# EAGLE design flync_node (EAGLE 9.6.2)
FLYNC/FIND battery-free sensor node

## Sheet 1 of 2
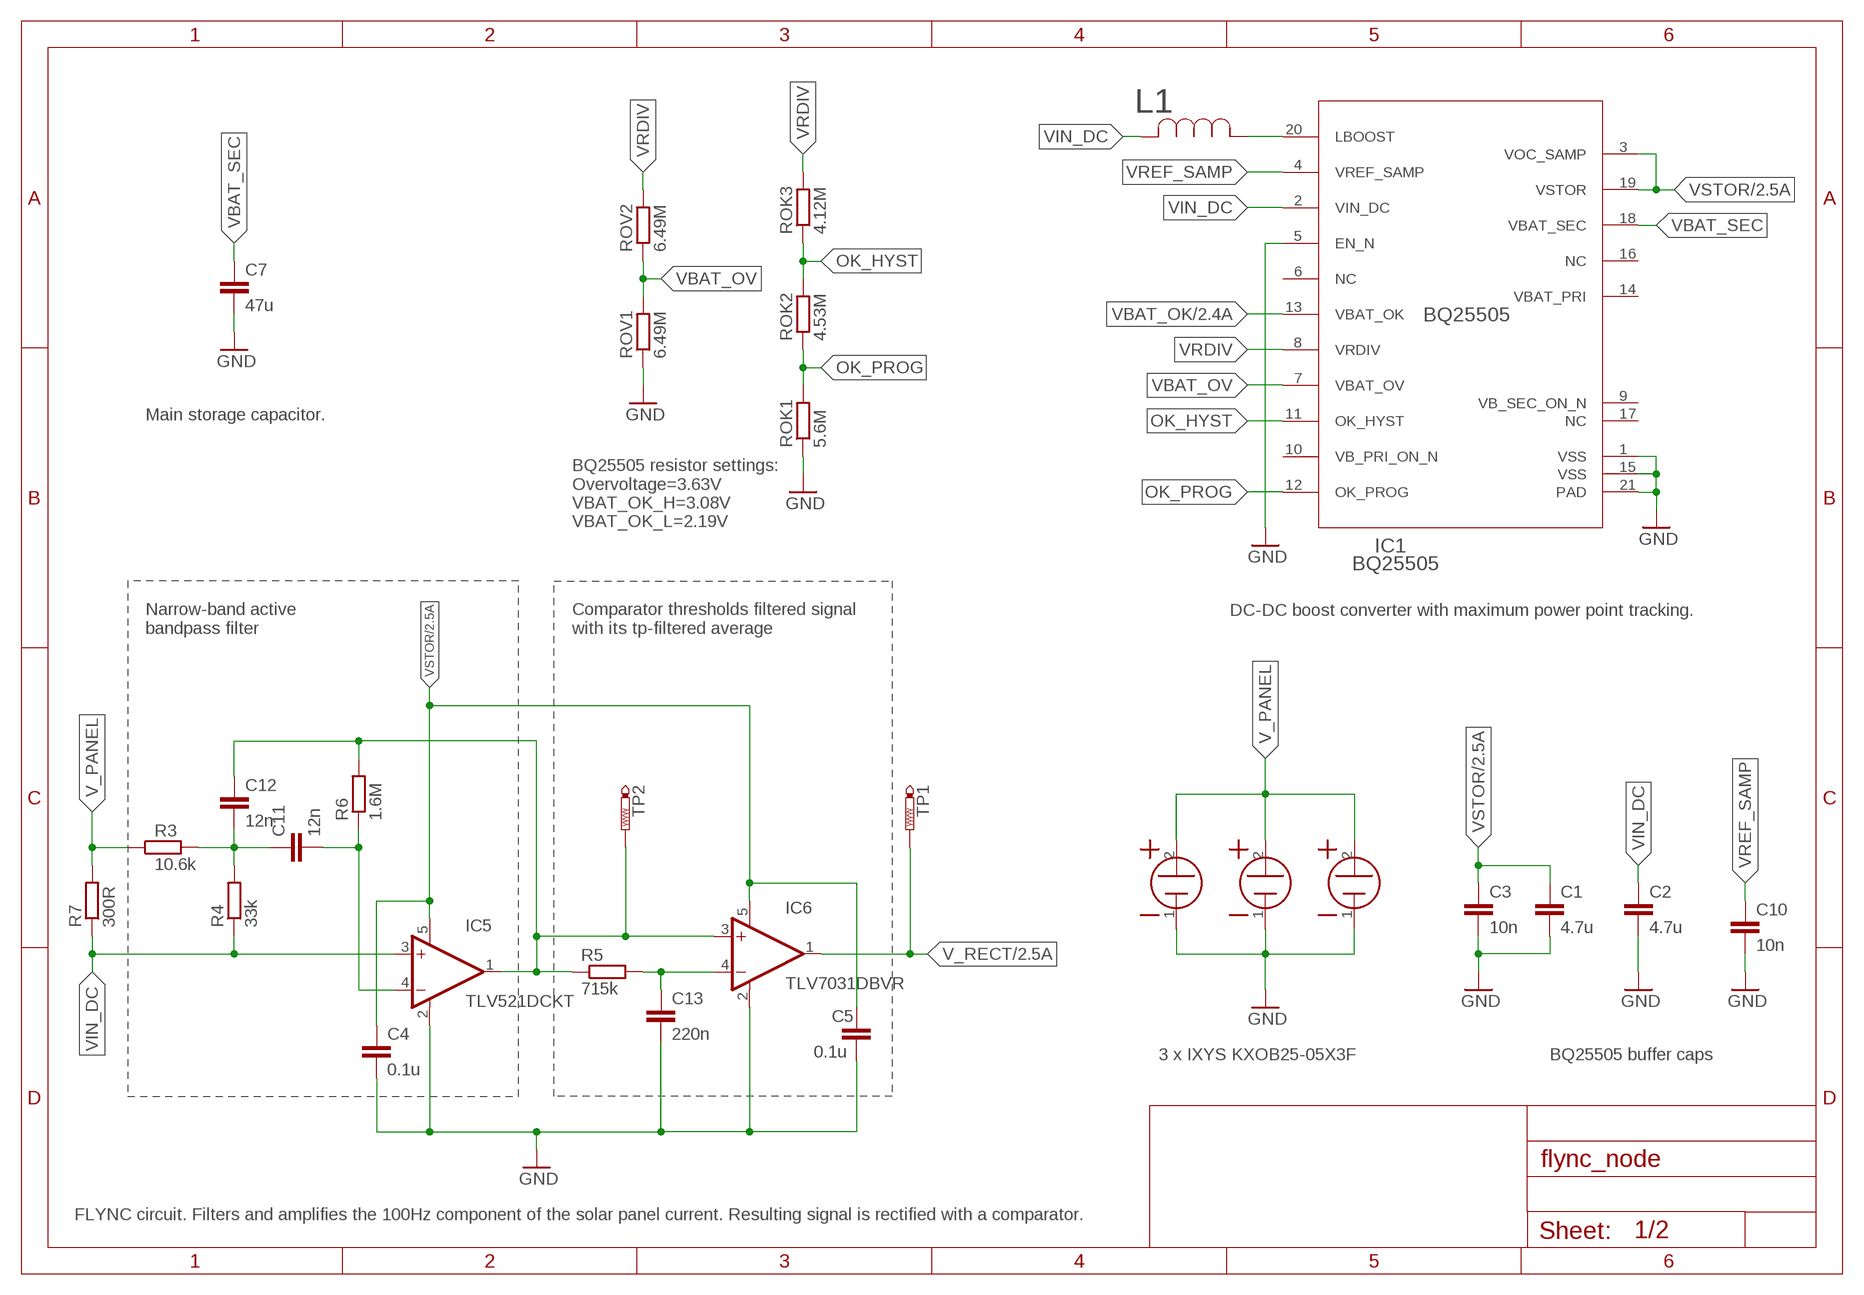
[diagram p0: schematic, sheet 1]

### Parts
C1  4.7u  C_SMD0402  [CAPC1005X55]
C2  4.7u  C_SMD0402  [CAPC1005X55]
C3  10n  C_SMD0402  [CAPC1005X55]
C4  0.1u  C_SMD0402  [CAPC1005X55]
C5  0.1u  C_SMD0402  [CAPC1005X55]
C7  47u  C_SMD0805  [CAPC2012X145]
C10  10n  C_SMD0402  [CAPC1005X55]
C11  12n  C_SMD0805  [CAPC2012X145]
C12  12n  C_SMD0805  [CAPC2012X145]
C13  220n  C_SMD0402  [CAPC1005X55]
H1  IXYSKXOB25-05X3F  [IXYS23X8]
H2  IXYSKXOB25-05X3F  [IXYS23X8]
H3  IXYSKXOB25-05X3F  [IXYS23X8]
IC1  BQ25505  [RGR0020A]
IC5  TLV521DCKT  [DCK5]
IC6  TLV7031DBVR  [DBV5-L]
L1  LBR2518T220KIND1007_47N_TAI-L  [IND1007_47N_TAI-L]
R3  10.6k  R_SMD0402  [RESC1005X40]
R4  33k  R_SMD0402  [RESC1005X40]
R5  715k  R_SMD0402  [RESC1005X40]
R6  1.6M  R_SMD0402  [RESC1005X40]
R7  300R  R_SMD0603  [RESC1608X55]
ROK1  5.6M  R_SMD0402  [RESC1005X40]
ROK2  4.53M  R_SMD0402  [RESC1005X40]
ROK3  4.12M  R_SMD0402  [RESC1005X40]
ROV1  6.49M  R_SMD0402  [RESC1005X40]
ROV2  6.49M  R_SMD0402  [RESC1005X40]
TP1  PTR1TP08R  [TP08R]
TP2  PTR1TP08R  [TP08R]

### Nets
GND: C1.2 C2.2 C3.2 C4.2 C5.2 C7.2 C10.2 C13.2 H1.1 H2.1 H3.1 IC1.1(VSS) IC1.5(EN_N) IC1.15(VSS) IC1.21(PAD) IC5.2(V-) IC6.2(V-) ROK1.1 ROV1.1 ; also sheet 2
N$1: IC1.20(LBOOST) L1.1
N$2: C11.1 C12.2 R3.2 R4.2
N$3: C11.2 IC5.4(-IN) R6.1
N$4: C12.1 IC5.1(OUT) IC6.3(+IN) R5.1 R6.2 TP2.TP
N$8: C13.1 IC6.4(-IN) R5.2
OK_HYST: IC1.11(OK_HYST) ROK2.2 ROK3.1
OK_PROG: IC1.12(OK_PROG) ROK1.2 ROK2.1
V_PANEL: H1.2 H2.2 H3.2 R3.1 R7.2
V_RECT: IC6.1(OUT) TP1.TP ; also sheet 2
VBAT_OK: IC1.13(VBAT_OK) ; also sheet 2
VBAT_OV: IC1.7(VBAT_OV) ROV1.2 ROV2.1
VBAT_SEC: C7.1 IC1.18(VBAT_SEC)
VIN_DC: C2.1 IC1.2(VIN_DC) IC5.3(+IN) L1.2 R4.1 R7.1
VRDIV: IC1.8(VRDIV) ROK3.2 ROV2.2
VREF_SAMP: C10.1 IC1.4(VREF_SAMP)
VSTOR: C1.1 C3.1 C4.1 C5.1 IC1.3(VOC_SAMP) IC1.19(VSTOR) IC5.5(V+) IC6.5(V+) ; also sheet 2
Unconnected: IC1.6(NC) IC1.10(VB_PRI_ON_N) IC1.16(NC) IC1.17(NC)

### Notes on the sheet
- Main storage capacitor.
- BQ25505 resistor settings:
  Overvoltage=3.63V
  VBAT_OK_H=3.08V
  VBAT_OK_L=2.19V
- DC-DC boost converter with maximum power point tracking.
- Narrow-band active
  bandpass filter
- Comparator thresholds filtered signal
  with its tp-filtered average
- 3 x IXYS KXOB25-05X3F | BQ25505 buffer caps
- FLYNC circuit. Filters and amplifies the 100Hz component of the solar panel current. Resulting signal is rectified with a comparator.

## Sheet 2 of 2
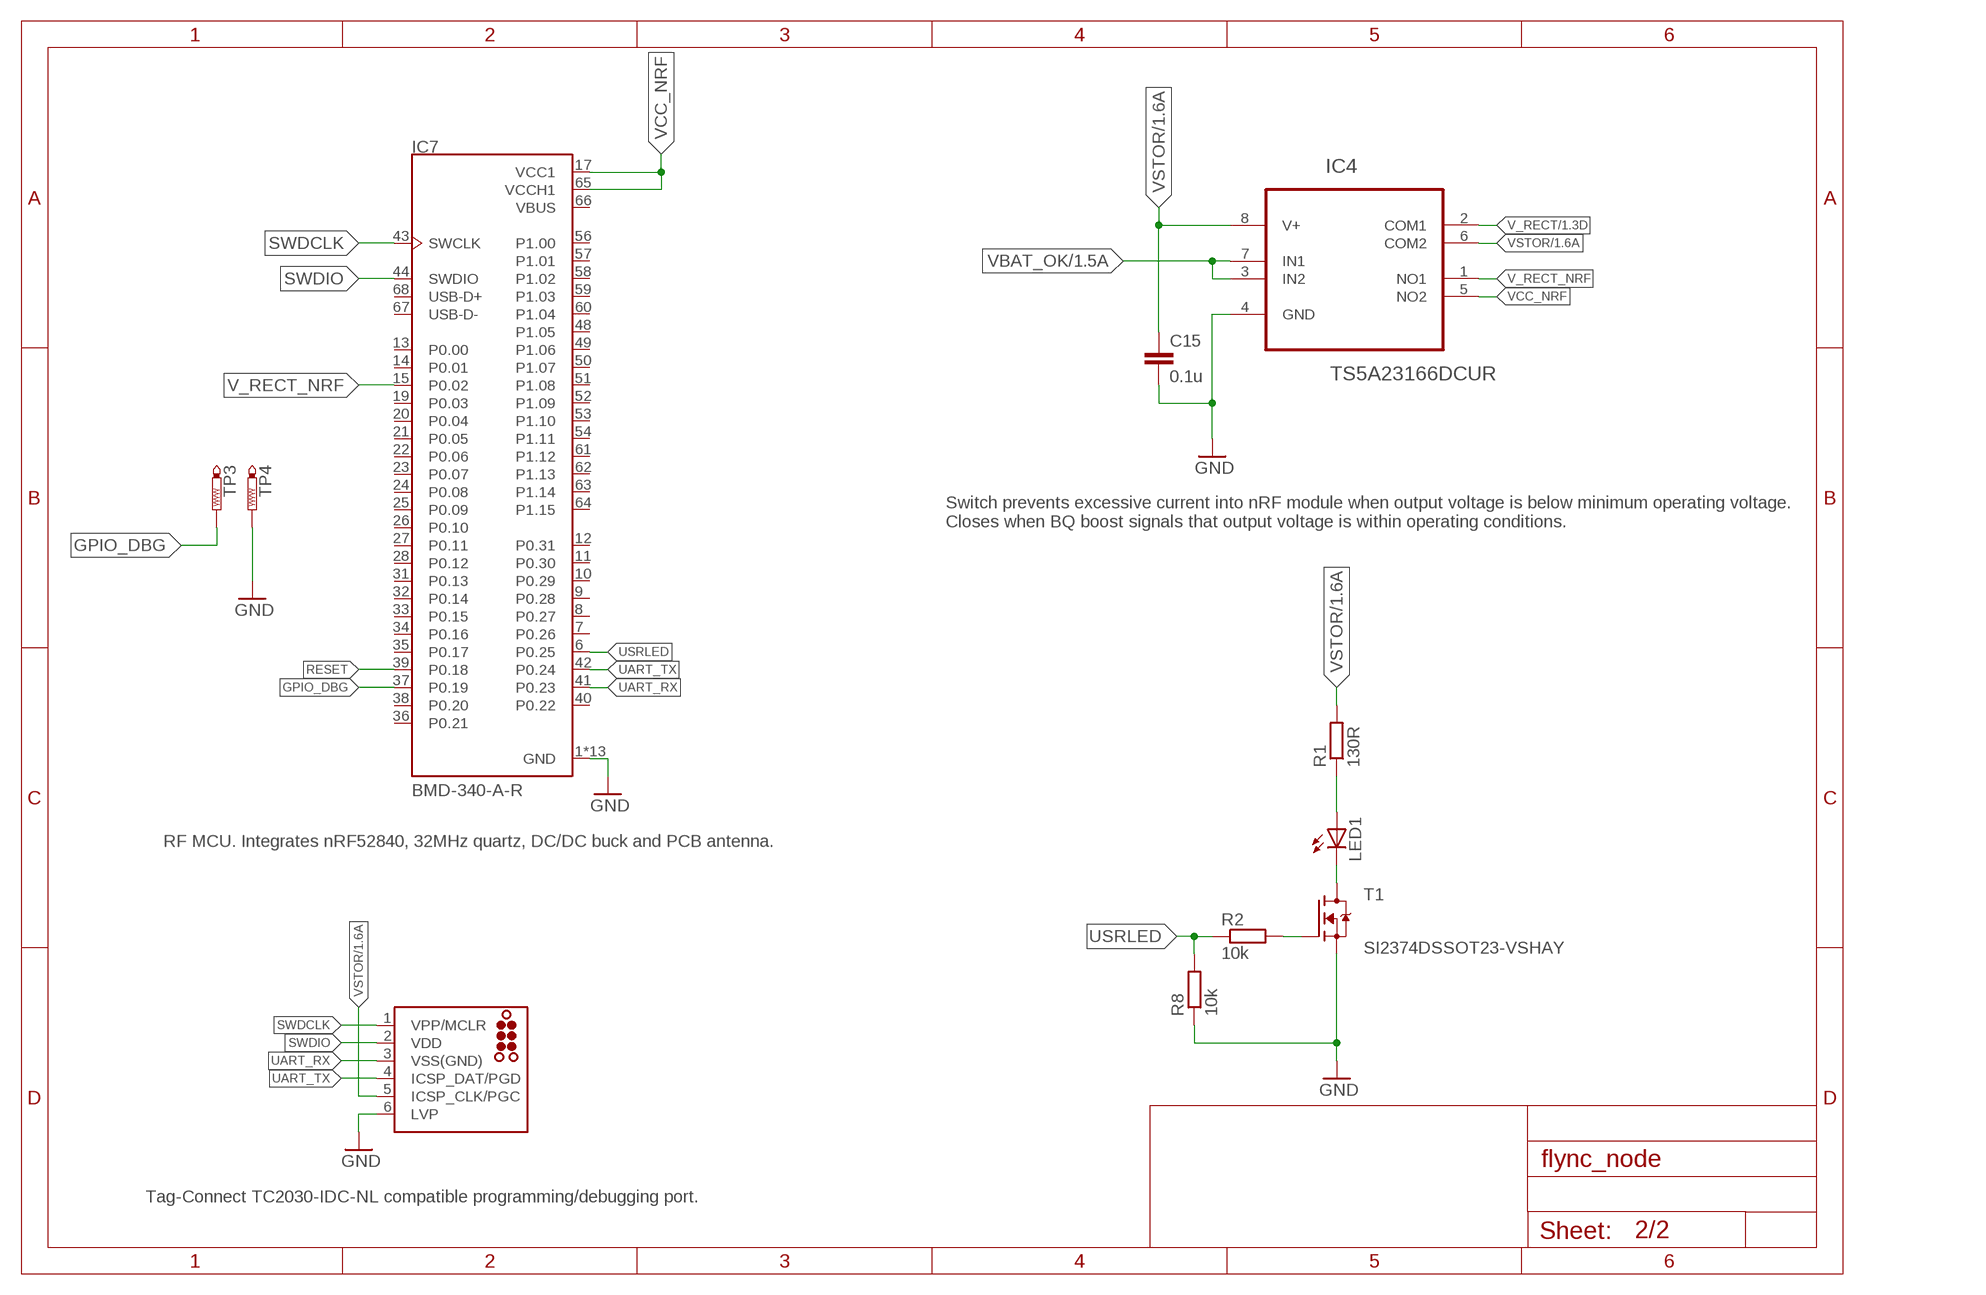
[diagram p1: schematic, sheet 2]

### Parts
C15  0.1u  C_SMD0402  [CAPC1005X55]
IC4  TS5A23166DCUR  [SOP50P310X90-8N]
IC7  BMD-340-A-R  [RIGADO_BMD-340-A-R]
J1  TC2030-MCP-NL  [TC2030-MCP-NL]
LED1  598-8130-107FLED_0805  [LEDC2012X75]
R1  130R  R_SMD0603  [RESC1608X55]
R2  10k  R_SMD0402  [RESC1005X40]
R8  10k  R_SMD0402  [RESC1005X40]
T1  SI2374DSSOT23-VSHAY  [SOT95P237X112-3]
TP3  PTR1TP16SQ  [TP16SQ]
TP4  PTR1TP16SQ  [TP16SQ]

### Nets
GND: C15.2 IC4.4(GND) IC7.1(GND) IC7.2(GND) IC7.3(GND) IC7.4(GND) IC7.5(GND) IC7.16(GND) IC7.18(GND) IC7.29(GND) IC7.30(GND) IC7.45(GND) IC7.46(GND) IC7.47(GND) IC7.55(GND) J1.6(LVP) R8.1 T1.2(S) TP4.TP ; also sheet 1
GPIO_DBG: IC7.37(P0.19) TP3.TP
N$5: LED1.2(A) R1.1
N$6: LED1.1(C) T1.3(D)
N$9: R2.2 T1.1(G)
RESET: IC7.39(P0.18)
SWDCLK: IC7.43(SWCLK) J1.1(VPP/MCLR)
SWDIO: IC7.44(SWDIO) J1.2(VDD)
UART_RX: IC7.41(P0.23) J1.3(VSS(GND))
UART_TX: IC7.42(P0.24) J1.4(ICSP_DAT/PGD)
USRLED: IC7.6(P0.25) R2.1 R8.2
V_RECT: IC4.2(COM1) ; also sheet 1
V_RECT_NRF: IC4.1(NO1) IC7.15(P0.02)
VBAT_OK: IC4.3(IN2) IC4.7(IN1) ; also sheet 1
VCC_NRF: IC4.5(NO2) IC7.17(VCC1) IC7.65(VCCH1)
VSTOR: C15.1 IC4.6(COM2) IC4.8(V+) J1.5(ICSP_CLK/PGC) R1.2 ; also sheet 1
Unconnected: IC7.7(P0.26) IC7.8(P0.27) IC7.9(P0.28) IC7.10(P0.29) IC7.11(P0.30) IC7.12(P0.31) IC7.13(P0.00) IC7.14(P0.01) IC7.19(P0.03) IC7.20(P0.04) IC7.21(P0.05) IC7.22(P0.06) IC7.23(P0.07) IC7.24(P0.08) IC7.25(P0.09) IC7.26(P0.10) IC7.27(P0.11) IC7.28(P0.12) IC7.31(P0.13) IC7.32(P0.14) IC7.33(P0.15) IC7.34(P0.16) IC7.35(P0.17) IC7.36(P0.21) IC7.38(P0.20) IC7.40(P0.22) IC7.48(P1.05) IC7.49(P1.06) IC7.50(P1.07) IC7.51(P1.08) IC7.52(P1.09) IC7.53(P1.10) IC7.54(P1.11) IC7.56(P1.00) IC7.57(P1.01) IC7.58(P1.02) IC7.59(P1.03) IC7.60(P1.04) IC7.61(P1.12) IC7.62(P1.13) IC7.63(P1.14) IC7.64(P1.15) IC7.67(USB-D-) IC7.68(USB-D+)

### Notes on the sheet
- Switch prevents excessive current into nRF module when output voltage is below minimum operating voltage.
  Closes when BQ boost signals that output voltage is within operating conditions.
- RF MCU. Integrates nRF52840, 32MHz quartz, DC/DC buck and PCB antenna.
- Tag-Connect TC2030-IDC-NL compatible programming/debugging port.

## Power pins joined to a net without a drawn wire
VB_SEC_ON_N: IC1.9(VB_SEC_ON_N)
VBAT_PRI: IC1.14(VBAT_PRI)
VBUS: IC7.66(VBUS)

## Library data of the parts
C1-C5 C7 C10-C13 C15 = flicker-sync:C_SMD
H1-H3 = flicker-sync:IXYSKXOB25-05X3F
IC1 = flicker-sync:BQ25505
IC4 = flicker-sync:TS5A23166DCUR: SPST ANALOG SWITCH; AVAILABILITY: Unavailable; DESCRIPTION: 0.9-Ohm Dual SPST Analog Switch 5-V/3.3-V 2-Channel Analog Switch 8-VSSOP -40 to 85; MF: Texas Instruments; MP: TS5A23166DCUR; PACKAGE: VFSOP-8 Texas Instruments; PRICE: None
IC5 = flicker-sync:TLV521DCKT; BUILT_BY: EMA_Molly; COPYRIGHT: Copyright (C) 2018 Accelerated Designs. All rights reserved; MANUFACTURER_PART_NUMBER: TLV521DCKT; VENDOR: Texas Instruments
IC6 = flicker-sync:TLV7031DBVR
IC7 = flicker-sync:BMD-340-A-R: Bluetooth Low Energy 5.0 Module; DESCRIPTION: Bluetooth Low Energy 5.0 Module; MF: Rigado; MP: BMD-340-A-R; PACKAGE: None
J1 = flicker-sync:TC2030: TAG-CONNECT ICSP Connector Manufacturer: Tag-Connect <http://www.tag-connect.com> Cable for easy In-Circuit Serial Programming. Designed for Microchip ICD2, suitable for many others. Two variants - one "with legs" (for hands-free fit on PCB) and another "without legs" for quick programming. PAD Description 1 MCLR/Vpp 2 Vdd 3 GND 4 PGD (ISPDAT) 5 PGC (ISPCLK) 6 nc (used for LVP) ©2009 ROFA.cz - modified and updated by Robert Darlington ‹rdarlington@gmail.com›
L1 = flicker-sync:LBR2518T220K; MANUFACTURER_PART_NUMBER: LBR2518T220K; VENDOR: Taiyo Yuden
LED1 = flicker-sync:598-8130-107F
R1-R8 ROK1-ROK3 ROV1 ROV2 = flicker-sync:R_SMD
T1 = flicker-sync:SI2374DS
TP1-TP4 = testpad:PTR1: TEST PIN

## Board
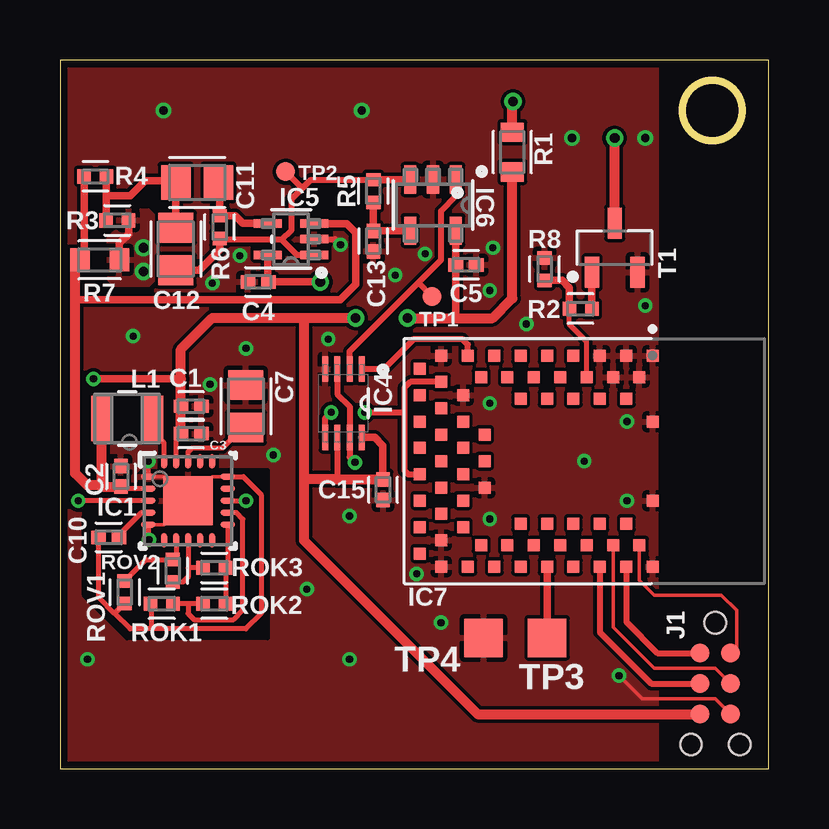
[diagram p2: board, top side]
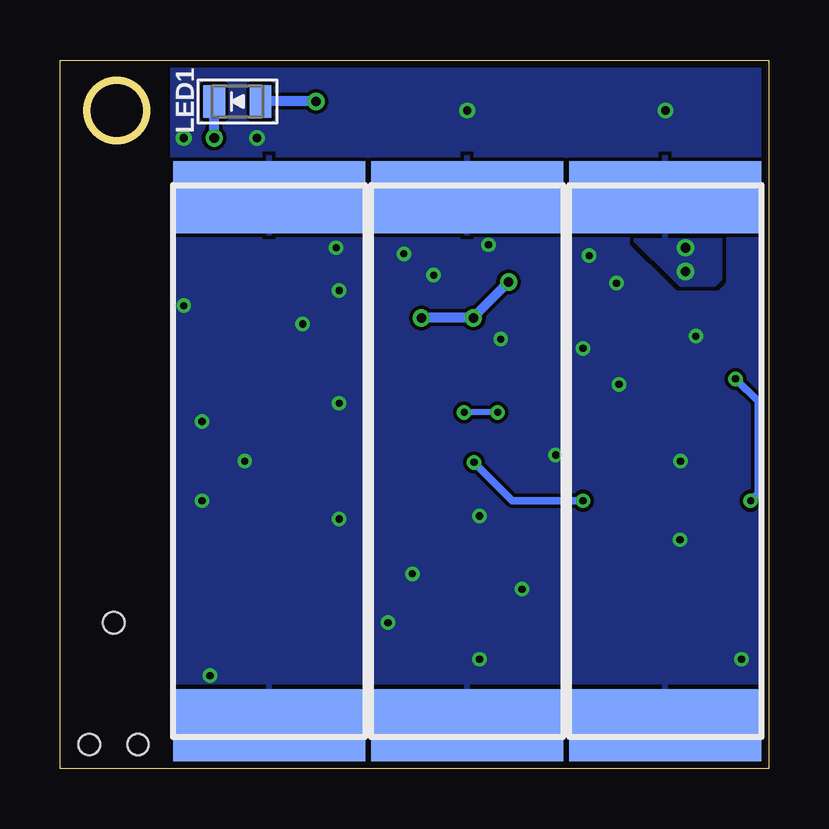
[diagram p3: board, bottom side, seen from below]

Size 29.54 x 29.54 mm. Coordinates in mm from the lower left corner, seen from the top.
Outline: 0,0 29.54,0 29.54,29.54 0,29.54 0,0
Outline: circle at 27.18,27.43 radius 1.25
Copper layers (1*16): Top 0.035mm / dielectric 1.5mm / Bottom 0.035mm
Design rules "PCB-POOL Standard *": minimum track width 0.15mm, minimum drill 0.3mm, track to track 0.15mm, track to pad 0.15mm, pad to pad 0.15mm, via to via 0.15mm, smd to smd 0.15mm, copper to edge 0.3mm, drill to drill 0.2mm, minimum pad ring 0.2mm, minimum via ring 0.15mm, stop-mask expansion 0.03mm, vias tented up to drill 20mil, thermal gap 0.2mm

### Footprints (pad centres in the part's own frame; a part is rotated, then mirrored left to right if it is on the bottom)
CAPC1005X55 = smd 0.608 x 0.562: 1 -0.427,0; 2 0.427,0
CAPC2012X145 = smd 1.234 x 1.453: 1 -0.884,0; 2 0.884,0
IXYS23X8 = smd 8 x 3: 1 0,11; 2 0,-11
RGR0020A = smd 0.6 x 0.24: 1 -1.65,1; 2 -1.65,0.5; 3 -1.65,0; 4 -1.65,-0.5; 5 -1.65,-1; 11 1.65,-1; 12 1.65,-0.5; 13 1.65,0; 14 1.65,0.5; 15 1.65,1 | smd 0.24 x 0.6: 6 -1,-1.65; 7 -0.5,-1.65; 8 0,-1.65; 9 0.5,-1.65; 10 1,-1.65; 16 1,1.65; 17 0.5,1.65; 18 0,1.65; 19 -0.5,1.65; 20 -1,1.65 | smd 2.05 x 2.05: 21 0,0
SOP50P310X90-8N = smd 1.067 x 0.254: 1 -1.422,0.762; 2 -1.422,0.254; 3 -1.422,-0.254; 4 -1.422,-0.762; 5 1.422,-0.762; 6 1.422,-0.254; 7 1.422,0.254; 8 1.422,0.762
DCK5 = smd 1.168 x 0.356: 1 -0.965,0.65; 2 -0.965,0; 3 -0.965,-0.65; 4 0.965,-0.65; 5 0.965,0.65
DBV5-L = smd 1.168 x 0.508: 1 -1.067,0.95; 2 -1.067,0; 3 -1.067,-0.95; 4 1.067,-0.95; 5 1.067,0.95
RIGADO_BMD-340-A-R = smd 0.5 x 0.5: 1 -2.85,-4.4; 2 -2.3,-3.5; 3 -1.75,-4.4; 4 -1.2,-3.5; 5 -0.65,-4.4; 6 -0.1,-3.5; 7 0.45,-4.4; 8 1,-3.5; 9 1.55,-4.4; 10 2.1,-3.5; 11 2.65,-4.4; 12 3.2,-3.5; 13 3.75,-4.4; 14 4.3,-3.5; 15 4.85,-4.4; 16 5.95,-4.4; 17 5.95,-3.3; 18 5.05,-2.75; 19 5.95,-2.2; 20 5.05,-1.65; 21 5.95,-1.1; 22 5.05,-0.55; 23 5.95,0; 24 5.05,0.55; 25 5.95,1.1; 26 5.05,1.65; 27 5.95,2.2; 28 5.05,2.75; 29 5.95,3.3; 30 5.95,4.4; 31 4.85,4.4; 32 4.3,3.5; 33 3.75,4.4; 34 3.2,3.5; 35 2.65,4.4; 36 2.1,3.5; 37 1.55,4.4; 38 1,3.5; 39 0.45,4.4; 40 -0.1,3.5; 41 -0.65,4.4; 42 -1.2,3.5; 43 -1.75,4.4; 44 -2.3,3.5; 45 -2.85,4.4; 46 -2.85,1.65; 47 -2.85,-1.65; 48 -1.75,-2.6; 49 -0.65,-2.6; 50 0.45,-2.6; 51 1.55,-2.6; 52 2.65,-2.6; 53 4.15,-1.1; 54 4.15,0; 55 4.15,1.1; 56 2.65,2.6; 57 1.55,2.6; 58 0.45,2.6; 59 -0.65,2.6; 60 -1.75,2.6; 61 6.85,-3.85; 62 6.85,-2.75; 63 6.85,-1.65; 64 6.85,-0.55; 65 6.85,0.55; 66 6.85,1.65; 67 6.85,2.75; 68 6.85,3.85
TC2030-MCP-NL = smd 0.787 x 0.787: 1 1.27,-0.635; 2 1.27,0.635; 3 2.54,-0.635; 4 2.54,0.635; 5 3.81,-0.635; 6 3.81,0.635 | hole 0.889: 0,0; 5.08,-1.016; 5.08,1.016
IND1007_47N_TAI-L = smd 0.864 x 1.905: 1 -1.067,0; 2 1.067,0
LEDC2012X75 = smd 0.91 x 1.35: 1 -0.96,0; 2 0.96,0
RESC1608X55 = smd 0.808 x 0.955: 1 -0.823,0; 2 0.823,0
RESC1005X40 = smd 0.56 x 0.6: 1 -0.47,0; 2 0.47,0
SOT95P237X112-3 = smd 1.298 x 0.597: 1 -1.027,0.95; 2 -1.027,-0.95; 3 1.027,0
TP08R = smd 0.8 x 0.8: TP 0,0
TP16SQ = smd 1.6 x 1.6: TP 0,0

### Placement (x,y rotation side)
C1  5.46,15.11 0 top
C2  2.54,12.19 90 top
C3  5.46,13.97 0 top
C4  8.26,20.29 180 top
C5  16.92,21.01 0 top
C7  7.75,15.11 90 top
C10  2.03,9.65 180 top
C11  5.71,24.43 0 top
C12  4.83,21.67 90 top
C13  13.06,22 270 top
C15  13.46,11.63 270 top
H1  4.32,12.83 180 bottom
H2  12.57,12.83 180 bottom
H3  20.83,12.83 180 bottom
IC1  5.33,11.18 0 top
IC4  11.81,15.24 270 top
IC5  9.63,22.07 180 top
IC6  15.54,23.5 270 top
IC7  21.84,12.83 180 top
J1  27.3,6.1 270 top
L1  2.79,14.61 180 top
LED1  22.15,27.81 0 bottom
R1  18.85,25.7 270 top
R2  21.69,19.18 0 top
R3  2.39,22.86 180 top
R4  1.47,24.69 0 top
R5  13.06,24.08 270 top
R6  6.65,22.58 270 top
R7  1.65,21.21 0 top
R8  20.19,20.83 270 top
ROK1  4.24,6.88 0 top
ROK2  6.43,6.88 0 top
ROK3  6.43,8.38 180 top
ROV1  2.69,7.37 90 top
ROV2  4.7,8.26 270 top
T1  23.11,21.72 90 top
TP1  15.49,19.68 0 top
TP2  9.4,24.89 0 top
TP3  20.29,5.46 0 top
TP4  17.65,5.46 0 top

### Tracks (layer width: path | path; a pad name or v marks a point on that pad's centre or on a via)
GND  (via drill 0.3, 0.35)
  Top 0.152: IC1.1 4.33,12.18 5.27,11.24 | 5.27,11.24 IC1.21 6.33,12.18 IC1.15 | IC1.5 4.33,10.18 5.27,11.11 5.27,11.24 | J1.6 27.3,2.92 24.26,2.92 v23.29,3.89
  Top 0.203: IC1.5 3.68,9.57 v3.71,9.55 | IC1.1 v3.68,12.83 | IC1.15 7.64,12.18 8.38,11.43 8.38,6.48 7.75,5.84 3.81,5.84 | C10.2 1.6,7.16 2.29,6.48 | 2.29,6.48 2.92,5.84 3.81,5.84 | ROK1.1 3.81,6.84 3.81,5.84 | ROV1.1 2.29,6.49 2.29,6.48
  Top 0.254: IC5.2 11.46,22.07 v11.68,21.84
  other vias: 14.86,8.13 24.38,19.3 8.89,13.08 17.91,15.24 17.91,10.41 23.62,11.18 23.62,14.48 21.84,12.83 15.21,21.46 6.35,20.24 18.03,21.72 6.25,16.03 3.05,18.03 12.06,10.54 11.18,17.91 15.88,6.1 1.14,4.57 12.06,4.57 10.29,7.49 19.43,18.54 17.91,19.94 13.97,20.57 7.49,21.39 24.38,26.29 21.34,26.29 12.57,27.43 4.32,27.43 7.75,17.53
  pour Top (rank 2): 0,29.54 24.84,29.54 24.84,0 0,0
  pour Bottom (rank 2): 0,0 24.84,0 24.84,29.54 0,29.54
GPIO_DBG
  Top 0.305: IC7.37 TP3.TP
N$1
  Top 0.203: L1.1 3.86,14.05 4.33,13.57 IC1.20
N$2
  Top 0.305: R3.2 1.92,23.88 | 1.92,23.88 1.92,24.66 R4.2 | 1.92,23.88 2.92,23.88 3.56,24.51 4.83,24.51 C11.1 C12.2
N$3
  Top 0.305: IC5.4 8.65,22.73 7.62,22.73 7.3,23.05 R6.1 6.66,24.38 C11.2
N$4
  Top 0.254: IC5.1 9.87,21.42 9.25,22.05 | R6.2 6.72,22.05 9.25,22.05 | 9.25,22.05 9.65,22.45 9.65,23.75 10.16,24.26 | 10.16,24.26 10.45,24.55 R5.1 | 10.16,24.26 10.03,24.26 TP2.TP
  Top 0.305: R6.2 6.66,21.64 5.8,20.78 C12.1 | R5.1 14.58,24.55 IC6.3
N$5  (via drill 0.4)
  Top 0.406: R1.1 18.85,27.81 v18.87,27.81
  Bottom 0.406: v18.87,27.81 LED1.2
N$6  (via drill 0.4)
  Top 0.406: T1.3 v23.11,26.29
  Bottom 0.406: v23.11,26.29 LED1.1
N$8
  Top 0.305: R5.2 C13.1 IC6.4
N$9
  Top 0.305: T1.1 R2.2
NOGND
  cutout Top: 8.64,12.45 8.64,5.46 2.79,5.46 1.02,7.24 1.02,10.54 4.19,10.54 6.1,12.45
OK_HYST
  Top 0.203: IC1.11 6.98,8.47 ROK3.1 ROK2.2
OK_PROG
  Top 0.203: IC1.12 7.36,10.68 7.62,10.41 7.62,6.6 7.24,6.22 5.59,6.22 5.33,6.48 5.33,6.88 | ROK2.1 5.33,6.88 | 5.33,6.88 ROK1.2
SWDCLK
  Top 0.254: IC7.43 23.59,6.12 24.89,4.83 J1.1
SWDIO
  Top 0.152: IC7.44 24.14,7.86 24.77,7.24 27.56,7.24 28.19,6.6 28.19,5.08 J1.2
UART_RX
  Top 0.254: IC7.41 22.49,5.7 24.64,3.56 J1.3
UART_TX
  Top 0.152: IC7.42 23.04,5.91 24.77,4.19 27.3,4.19 J1.4
USRLED
  Top 0.203: IC7.6 21.94,17.81 21.22,18.53 R2.1
  Top 0.305: R2.1 21.22,20.05 20.92,20.36 R8.2
V_PANEL  (via drill 0.4)
  Top 0.305: R3.1 2.86,22.29 2.47,21.91 R7.2
  other vias: 3.48,21.72 3.48,20.73
  pour Bottom: 0,25.48 24.84,25.48 24.84,22.35 5.84,22.35 3.68,20.19 2.29,20.19 2.03,20.45 2.03,22.35 0,22.35
  pour Top: 2.03,20.45 2.29,20.19 3.68,20.19 3.94,20.45 3.94,22.99 3.68,23.24 2.67,23.24 2.41,22.99 2.41,22.48 2.03,22.1
V_RECT
  Top 0.254: 14.92,20.26 12.06,17.4 IC4.2 | 14.92,20.26 15.88,21.21 15.88,23.24 16.5,23.86 IC6.1 | TP1.TP 14.92,20.26
V_RECT_NRF
  Top 0.254: IC7.15 16.99,17.68 16.76,17.91 14.73,17.91 13.49,16.66 IC4.1
VBAT_OK  (via drill 0.3)
  Top 0.203: IC1.13 v7.75,11.18
  Top 0.254: IC4.3 11.56,15.62 12.06,15.11 IC4.7 12.06,13.01 v12.29,12.78
  Bottom 0.305: v12.29,12.78 10.69,11.18 v7.75,11.18
VBAT_OV
  Top 0.203: IC1.7 4.83,8.86 ROV2.1 3.58,8.72 ROV1.2
VBAT_SEC
  Top 0.203: IC1.18 5.33,13.21 5.5,13.38 6.77,13.38 7.24,13.84 7.24,14.48 7.5,14.48 C7.1
VCC_NRF  (via drill 0.3)
  Top 0.254: IC7.17 14.6,16.13 14.35,15.88 14.35,14.86 | IC7.65 14.52,12.28 14.35,12.45 14.35,14.86 | IC4.5 11.05,14.61 v11.3,14.86 | v12.7,14.86 14.35,14.86
  Bottom 0.254: v11.3,14.86 v12.7,14.86
VIN_DC
  Top 0.203: IC1.2 2.63,11.68 C2.1
  Top 0.305: IC5.3 11.95,22.72 12.32,22.35 12.32,20.19 11.68,19.56 0.64,19.56 | R7.1 1,21.38 R4.1
  Top 0.406: C2.1 1.78,11.77 1.73,11.82 | L1.2 1.73,11.82 | 1.73,11.82 1.14,11.82 0.64,12.32 0.64,19.56 0.64,21.02 R7.1
VRDIV
  Top 0.203: IC1.8 5.33,8.38 | 5.33,8.38 5.33,8 5.12,7.79 ROV2.2 | ROK3.2 5.33,8.38
VREF_SAMP
  Top 0.203: IC1.4 3.39,10.68 2.46,9.75 C10.1
VSTOR  (via drill 0.3, 0.4)
  Top 0.203: IC1.19 4.83,13.77 C3.1 | IC1.3 v0.76,11.18
  Top 0.254: IC4.6 11.56,12.06
  Top 0.305: IC4.8 13.11,13.82 13.46,13.47 C15.1 | IC6.5 C5.1 16.49,18.81 16.51,18.79 | v10.85,20.3 C4.1 8.66,20.32 IC5.5 | 5.03,16.26 v1.4,16.26
  Top 0.406: C3.1 C1.1 5.03,16.26 5.03,17.48 6.35,18.8 10.16,18.8 | C15.1 11.56,12.06 10.16,12.06 | 10.16,18.8 v12.32,18.8 | J1.5 17.4,2.29 10.16,9.53 10.16,12.06 | 10.16,18.8 10.16,12.06 | v14.48,18.79 16.51,18.79 18.02,18.79 18.85,19.61 R1.2
  Bottom 0.305: v1.4,16.26 0.45,15.31 0.45,11.49 v0.76,11.18
  Bottom 0.406: v10.85,20.3 12.32,18.82 v12.32,18.8 v14.48,18.8 v14.48,18.79

### Text on the board
tStop: FLYNC v0.3 / NES-LAB TUD